# EAGLE design boarthed_to (EAGLE 9.6.2)
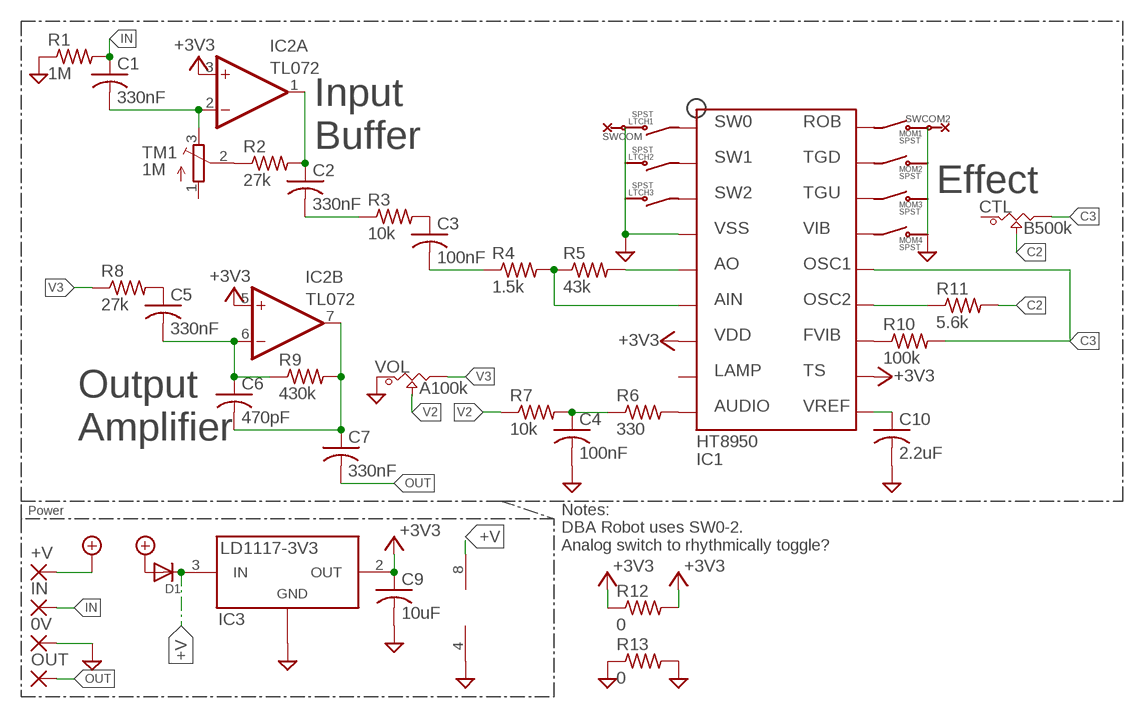
[diagram p0: schematic, sheet 1]

## Parts
0V  SMD2  [SMD1,27-2,54]
+V  SMD2  [SMD1,27-2,54]
C1  330nF  C-USC0603  [C0603]
C2  330nF  C-USC0603  [C0603]
C3  100nF  C-USC0603  [C0603]
C4  100nF  C-USC0603  [C0603]
C5  330nF  C-USC0603  [C0603]
C6  470pF  C-USC0603  [C0603]
C7  330nF  C-USC0603  [C0603]
C9  10uF  C-USC1206  [C1206]
C10  2.2uF  C-USC0603  [C0603]
CTL  B500k  POT_9MM_SMD  [POT_9MM_SMD]
D1  DIODESOD-123  [SOD-123]
IC2  TL072  TL072TSSOP  [TSSOP-8]
IC3  LD1117-3V3  LD1117S33TR  [SOT-223]
IN  SMD2  [SMD1,27-2,54]
LTCH1  SPST_1PAD  [1PAD]
LTCH2  SPST_1PAD  [1PAD]
LTCH3  SPST_1PAD  [1PAD]
MOM1  SPST_1PAD  [1PAD]
MOM2  SPST_1PAD  [1PAD]
MOM3  SPST_1PAD  [1PAD]
MOM4  SPST_1PAD  [1PAD]
OUT  SMD2  [SMD1,27-2,54]
R1  1M  R-US_R0603  [R0603]
R2  27k  R-US_R0603  [R0603]
R3  10k  R-US_R0603  [R0603]
R4  1.5k  R-US_R0603  [R0603]
R5  43k  R-US_R0603  [R0603]
R6  330  R-US_R0603  [R0603]
R7  10k  R-US_R0603  [R0603]
R8  27k  R-US_R0603  [R0603]
R9  430k  R-US_R0603  [R0603]
R10  100k  R-US_R0603  [R0603]
R11  5.6k  R-US_R0603  [R0603]
R12  0  R-US_R0402  [R0402]
R13  0  R-US_R0402  [R0402]
SWCOM  COM_SMD  [1PAD]
SWCOM2  COM_SMD  [1PAD]
TM1  1M  TRIMPOTTC33X  [TC33X]
U$4  HT8950  [PDIP-18]
VOL  A100k  POT_9MM_SMD  [POT_9MM_SMD]

## Nets
+3V3: C9.1 IC2.3(A:+IN) IC2.5(B:+IN) IC3.2(OUT) IC3.4 R12.1 R12.2 U$4.7(VDD) U$4.11(TS)
+9V: +V.1(P) D1.A
+V: D1.C IC2.8(P:V+) IC3.3(IN)
C2: CTL.2 R11.2
C3: CTL.3 R10.2 U$4.14(OSC1)
GND: 0V.1(P) C4.2 C9.2 C10.2 IC2.4(P:V-) IC3.1(ADJ/GND) R1.1 R13.1 R13.2 SWCOM2.1 SWCOM.1 U$4.4(VSS) VOL.1
IN: C1.1 IN.1(P) R1.2
N$2: LTCH1.1 U$4.1(SW0)
N$3: LTCH2.1 U$4.2(SW1)
N$4: LTCH3.1 U$4.3(SW2)
N$5: MOM1.1 U$4.18(ROB)
N$6: MOM2.1 U$4.17(TGD)
N$7: MOM3.1 U$4.16(TGU)
N$8: MOM4.1 U$4.15(VIB)
N$9: C10.1 U$4.10(VREF)
N$10: C1.2 IC2.2(A:-IN) TM1.3(E)
N$11: R2.1 TM1.2(S)
N$12: C2.1 IC2.1(A:OUT) R2.2
N$13: C2.2 R3.1
N$14: C3.1 R3.2
N$15: C3.2 R4.1
N$16: R4.2 R5.1 U$4.6(AIN)
N$17: R5.2 U$4.5(AO)
N$18: R6.2 U$4.9(AUDIO)
N$19: C4.1 R6.1 R7.2
N$20: C5.1 R8.2
N$21: C5.2 C6.1 IC2.6(B:-IN) R9.1
N$22: C6.2 C7.1 IC2.7(B:OUT) R9.2
N$23: R10.1 U$4.12(FVIB)
N$24: R11.1 U$4.13(OSC2)
OUT: C7.2 OUT.1(P)
V2: R7.1 VOL.2
V3: R8.1 VOL.3
Unconnected: CTL.1 TM1.1(A) U$4.8(LAMP)

## Notes on the sheet
- Input
  Buffer
- Effect
- Output
  Amplifier
- Power
- Notes:
  DBA Robot uses SW0-2.
- Analog switch to rhythmically toggle?

## Library data of the parts
0V +V IN OUT = wirepad:SMD2: SMD PAD
C1-C7 C9 C10 = adafruit:C-US: CAPACITOR, American symbol
CTL VOL = Mech_BO_CE_SW:POT_9MM_SMD
D1 = adafruit:DIODE: Diode SMADIODE - SMA Surface Mount Package 20V 1A Schottky Diode Digikey: 641-1014-6-ND DO-1N4148 - Through Hole Small Current Diode SOD-123 20V 1 A (.5mV Vf) Schottky Diode - Digikey: MBRX120TPMSCT-ND SOD-323 10V 570mA (.38mV Vf, 3ns) Schottky Diode - Digikey: ZLLS410CT-ND SOD-523 30V 30mA Schottky Diode (RB751S-40TE61) - Digikey: RB751S-40TE61CT-ND SOT23-R/W - SOT23 Package (R = Solder Paste/Reflow Ovens, W = Hand-Soldering) BAT54Film 40V 300mA - Digikey: 497-7162-1-ND
IC2 = MusicThingModular:TL072: Generic Dual Op Amp
IC3 = IC:LD1117S33TR: IC REG LINEAR 3.3V 800MA SOT223 Manufacturer's datasheet <http://www.st.com/content/ccc/resource/technical/document/datasheet/99/3b/7d/91/91/51/4b/be/CD00000544.pdf/files/CD00000544.pdf/jcr:content/translations/en.CD00000544.pdf>; CREATED_BY: PCBLayout.com; DIGIKEY_PART_NUMBER: 497-1242-2-ND; MANUFACTURER: STMicroelectronics; MPN: LD1117S33TR; PACKAGE: SOT-223
LTCH1-LTCH3 MOM1-MOM4 = Mech_BO_CE_SW:SPST_1PAD
R1-R13 = adafruit:R-US_: RESISTOR, American symbol
SWCOM SWCOM2 = Mech_BO_CE_SW:COM_SMD
TM1 = adafruit:TRIMPOT: SMT trimmer potentiometer part number TC33X http://www.ladyada.net/library/eagle
U$4 = HT8950:HT8950

## Board
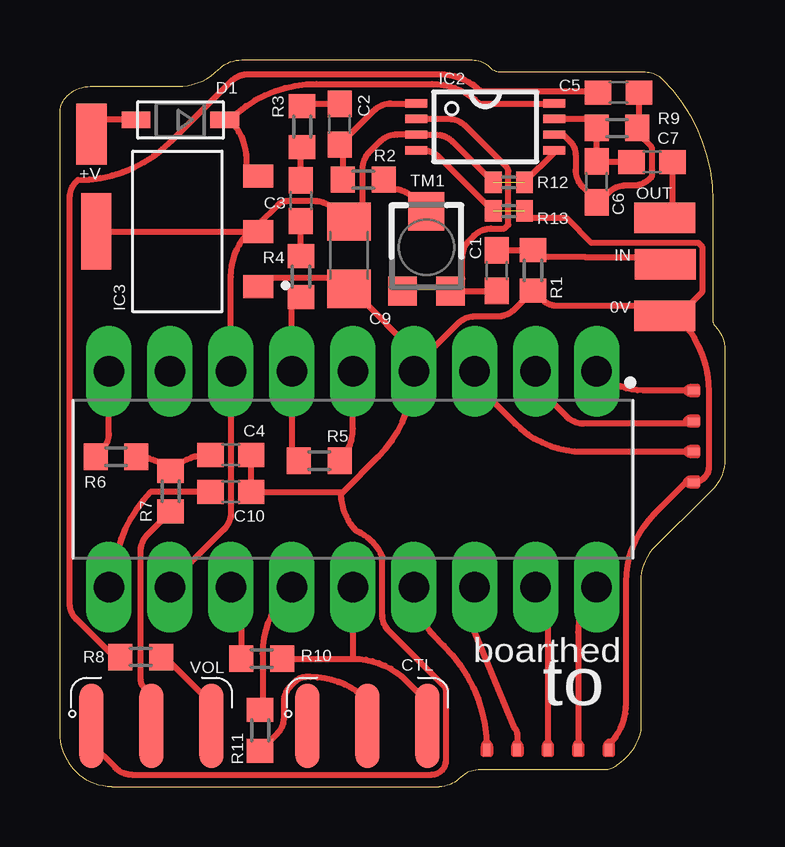
[diagram p1: board, top side]

Size 27.7 x 30.3 mm. Coordinates in mm from the lower left corner, seen from the top.
Outline: 0,2.29 0,28.08 arc-45 0.3,28.8 arc-45 1.27,29.2 4.91,29.2 arc45 6.6,29.9 arc-45 7.57,30.3 17.18,30.3 arc-45 17.9,30 arc45 18.38,29.8 24.38,29.8 arc-45 25.1,29.5 arc-45 27.2,24.43 27.2,19.44 arc45 27.3,19.2 arc-45 27.7,18.23 27.7,13.5 arc-45 27.03,12.23 24.67,9.87 arc45 24.2,8.4 24.2,2.35 arc-45 23.2,0.9 arc-45 22.72,0.7 17.52,0.7 arc45 16.7,0.4 arc-45 15.8,0 2.15,0 arc-45 0.7,0.6 arc-45 0,2.29
Copper layers (1*16): Top 0.035mm / dielectric 1.5mm / Bottom 0.035mm
Design rules "default *": minimum track width 6mil, minimum drill 0.35mm, track to track 6mil, track to pad 6mil, pad to pad 6mil, via to via 6mil, smd to smd 6mil, copper to edge 10mil, drill to drill 6mil, minimum pad ring 10mil, minimum via ring 8mil, stop-mask expansion 4mil, vias tented up to drill 0mil, thermal gap 10mil

### Footprints (pad centres in the part's own frame; a part is rotated, then mirrored left to right if it is on the bottom)
SMD1,27-2,54 = smd 1.27 x 2.54: 1 0,0
C0603 = smd 1.1 x 1: 1 -0.85,0; 2 0.85,0
C1206 = smd 1.6 x 1.8: 1 -1.4,0; 2 1.4,0
POT_9MM_SMD = smd 0.991 x 3.505: 1 -2.5,0; 2 0,0; 3 2.5,0
SOD-123 = smd 1.2 x 0.7: A 1.85,0; C -1.85,0
TSSOP-8 = smd 0.9 x 0.35: 1 -2.875,0.975; 2 -2.875,0.325; 3 -2.875,-0.325; 4 -2.875,-0.975; 5 2.875,-0.975; 6 2.875,-0.325; 7 2.875,0.325; 8 2.875,0.975
SOT-223 = smd 1.26 x 0.96: 1 -3.375,2.3; 2 -3.375,0; 3 -3.375,-2.3 | smd 1.26 x 3.19: 4 3.375,0
1PAD = smd 0.31 x 0.5: 1 0,0.267
R0603 = smd 1 x 1.1: 1 -0.85,0; 2 0.85,0
R0402 = smd 0.7 x 0.9: 1 -0.65,0; 2 0.65,0
TC33X = smd 1.2 x 1.2: 1 -1,-1.825; 3 1,-1.825 | smd 1.5 x 1.6: 2 0,1.5
PDIP-18 = drill 1.27 pad 1.524 long: 1 -4.5,10.16; 2 -4.5,7.62; 3 -4.5,5.08; 4 -4.5,2.54; 5 -4.5,0; 6 -4.5,-2.54; 7 -4.5,-5.08; 8 -4.5,-7.62; 9 -4.5,-10.16; 10 4.5,-10.16; 11 4.5,-7.62; 12 4.5,-5.08; 13 4.5,-2.54; 14 4.5,0; 15 4.5,2.54; 16 4.5,5.08; 17 4.5,7.62; 18 4.5,10.16

### Placement (x,y rotation side)
0V  25.19,19.64 90 top
+V  1.32,27.21 180 top
C1  18.19,21.52 270 top
C2  11.66,27.62 90 top
C3  10.04,24.43 270 top
C4  7.12,13.84 0 top
C5  23.27,28.94 0 top
C6  22.36,25.22 90 top
C7  24.67,26.04 0 top
C9  12.04,22.16 270 top
C10  7.12,12.29 0 top
CTL  12.81,2.54 0 top
D1  5.02,27.8 180 top
IC2  17.72,27.51 0 top
IC3  4.89,23.15 180 top
IN  25.21,21.77 90 top
LTCH1  26.67,16.51 90 top
LTCH2  26.67,15.24 90 top
LTCH3  26.67,13.97 90 top
MOM1  21.59,1.27 0 top
MOM2  20.32,1.27 0 top
MOM3  19.05,1.27 0 top
MOM4  17.78,1.27 0 top
OUT  25.19,23.71 270 top
R1  19.71,21.53 90 top
R2  12.64,25.31 180 top
R3  10.09,27.52 270 top
R4  10.04,21.27 270 top
R5  10.8,13.59 0 top
R6  2.33,13.76 180 top
R7  4.61,12.32 90 top
R8  3.36,5.41 180 top
R9  23.21,27.46 180 top
R10  8.41,5.34 0 top
R11  8.34,2.35 270 top
R12  18.7,25.2 0 top
R13  18.7,24 0 top
SWCOM  26.67,12.7 90 top
SWCOM2  22.86,1.27 0 top
TM1  15.27,22.49 0 top
U$4  12.2,12.82 270 top
VOL  3.81,2.54 0 top

### Tracks (layer width: path | path; a pad name or v marks a point on that pad's centre or on a via)
+3V3  (1 unrouted)
  Top 0.254: U$4.11 4.58,8.47 6.83,10.72 arc45 7.12,11.43 U$4.7 7.12,21.27 arc-45 7.9,23.15 | IC3.4 7.9,23.15 | 7.9,23.15 IC3.2 8.27,23.45 9.07,24.26 arc-45 9.44,24.41 10.64,24.41 arc-45 11.35,24.12 11.9,23.56 C9.1 12.61,24.13 12.61,25.76 arc-45 12.9,26.47 13.33,26.89 arc-45 14.03,27.18 IC2.3 15.65,27.18 arc-45 16.36,26.89 R12.1 | R12.2 20.59,26.45 IC2.5
+9V
  Top 0.254: D1.A 1.91,27.8 +V.1
+V
  Top 0.254: D1.C 7.07,27.8 | 7.07,27.8 arc-45 7.76,26.12 7.76,25.85 8.16,25.45 IC3.3 | IC2.8 17.46,28.48 arc45 15.5,29.3 10.69,29.3 arc45 7.07,27.8
C2
  Top 0.254: R11.2 9.07,2.23 arc45 9.34,2.87 9.34,3.54 arc-45 9.6,4.18 9.83,4.41 arc-45 10.22,4.57 10.45,4.57 arc-45 12.81,3.59 CTL.2
C3
  Top 0.254: R10.2 12.2,5.34 | 12.2,5.34 arc-45 14.44,4.41 15.31,3.54 CTL.3 | U$4.14 12.2,5.34
GND  (1 unrouted)
  Top 0.254: IC3.1 8.61,21.2 11.6,21.2 C9.2 12.14,20.76 15.04,17.86 15.04,17.62 U$4.4 | C4.2 C10.2 11.79,12.29 | 11.79,12.29 11.72,12.21 arc45 12.37,10.64 arc-45 13.43,9.58 13.43,7.14 arc45 13.7,6.51 16,4.21 arc-45 16.09,3.99 16.09,1.11 arc-90 15.48,0.51 3,0.51 arc-45 2.3,0.8 1.31,1.79 VOL.1 | 11.79,12.29 13.27,13.76 arc45 U$4.4 | U$4.4 14.74,17.48 16.58,19.31 arc-45 17.28,19.6 18.22,19.6 arc45 18.93,19.9 R1.1 20.06,20.33 arc45 20.76,20.04 24.79,20.04 0V.1 25.48,19.34 25.73,19.59 | IC2.4 15.1,26.54 arc-45 15.81,26.24 R13.1 | 25.73,19.59 arc-45 27.03,16.46 27.03,13.33 arc-90 SWCOM.1 26.1,12.7 24.76,11.36 arc45 23.59,8.54 23.59,3.49 arc-45 22.86,1.73 SWCOM2.1 | R13.2 19.65,23.7 21.13,23.7 22.15,22.68 26.6,22.68 26.76,22.52 26.76,20.62 25.73,19.59
IN
  Top 0.254: C1.1 R1.2 20.01,22.08 21.9,22.08 21.91,22.07 24.91,22.07 IN.1
N$2
  Top 0.254: U$4.1 arc45 24.29,16.52 26.38,16.52 arc-45 LTCH1.1
N$3
  Top 0.254: U$4.2 19.82,16.72 21.11,15.43 arc45 21.82,15.14 26.3,15.14 LTCH2.1
N$4
  Top 0.254: U$4.3 17.28,16.82 18.96,15.14 arc45 21.79,13.97 LTCH3.1
N$5
  Top 0.254: U$4.18 22.36,8.31 arc45 21.59,6.45 MOM1.1
N$6
  Top 0.254: U$4.17 19.82,8.24 20.32,7.74 MOM2.1
N$7
  Top 0.254: MOM3.1 19.05,2.19 arc45 18.95,2.44 17.28,6.46 arc-45 U$4.16
N$8
  Top 0.254: U$4.15 arc45 15.58,6.3 16,5.88 arc-45 17.79,1.55 MOM4.1
N$9
  Top 0.254: C10.1 3.79,12.29 arc45 2.22,8.5 U$4.10
N$10
  Top 0.254: C1.2 TM1.3 16.77,21.16 16.77,22.08 arc-45 17.06,22.79 17.25,22.98 arc-45 17.96,23.27 18.52,23.27 18.68,23.43 18.68,25.65 arc45 18.6,25.85 16.9,27.54 arc45 16.2,27.84 IC2.2
N$11
  Top 0.254: TM1.2 14.64,24.62 arc45 13.94,24.91 13.89,24.91 R2.1
N$12
  Top 0.254: R2.2 11.79,26.64 C2.1 13.08,28.19 arc-45 13.79,28.48 IC2.1
N$13
  Top 0.254: R3.1 10.19,28.47 C2.2
N$14
  Top 0.254: C3.1 10.04,26.62 R3.2
N$15
  Top 0.254: R4.1 C3.2
N$16
  Top 0.254: R5.1 9.65,13.89 U$4.6 9.66,20.04 R4.2
N$17
  Top 0.254: R5.2 arc45 12.2,14.92 U$4.5
N$18
  Top 0.254: R6.2 1.75,14.03 arc45 2.04,14.73 U$4.9
N$19
  Top 0.254: R6.1 R6.1 arc-45 R7.2 arc-45 6.23,13.84 C4.1
N$20
  Top 0.254: R8.2 2.25,5.41 0.67,7 arc-45 0.41,7.63 0.41,24.55 arc-45 0.7,25.25 0.74,25.3 arc45 4.63,26.91 7.14,29.41 arc-45 7.84,29.71 15.82,29.71 arc-45 17.52,29 22.36,29 C5.1
N$21
  Top 0.254: C5.2 24.12,27.52 R9.1 24.06,27.25 24.65,26.66 24.65,25.42 24.58,25.35 arc-45 23.87,25.06 23.57,25.06 arc45 22.86,24.77 22.46,24.37 C6.1 22.36,24.43 21.77,25.01 arc-45 21.48,25.72 21.48,26.36 arc45 21.26,26.89 20.96,27.18 IC2.6
N$22
  Top 0.254: C7.1 22.39,26.04 C6.2 R9.2 22,27.84 IC2.7
N$23
  Top 0.254: U$4.12 7.56,7.88 R10.1
N$24
  Top 0.254: R11.1 8.44,3.3 8.44,5.54 arc-45 9.54,8.2 U$4.13
OUT
  Top 0.254: C7.2 25.52,24.04 OUT.1
V2
  Top 0.254: R7.1 3.64,10.5 arc45 3.35,9.79 3.35,4.52 arc45 3.51,4.12 3.51,2.84 VOL.2
V3
  Top 0.254: VOL.3 6.09,2.76 6.09,3.32 arc45 5.83,3.95 4.48,5.3 arc45 R8.1

### Text on the board
tPlace: boarthed | to